# Altium schematic sheet PCI Express_16765X6890_36PIN_Half length.schdoc
size A4
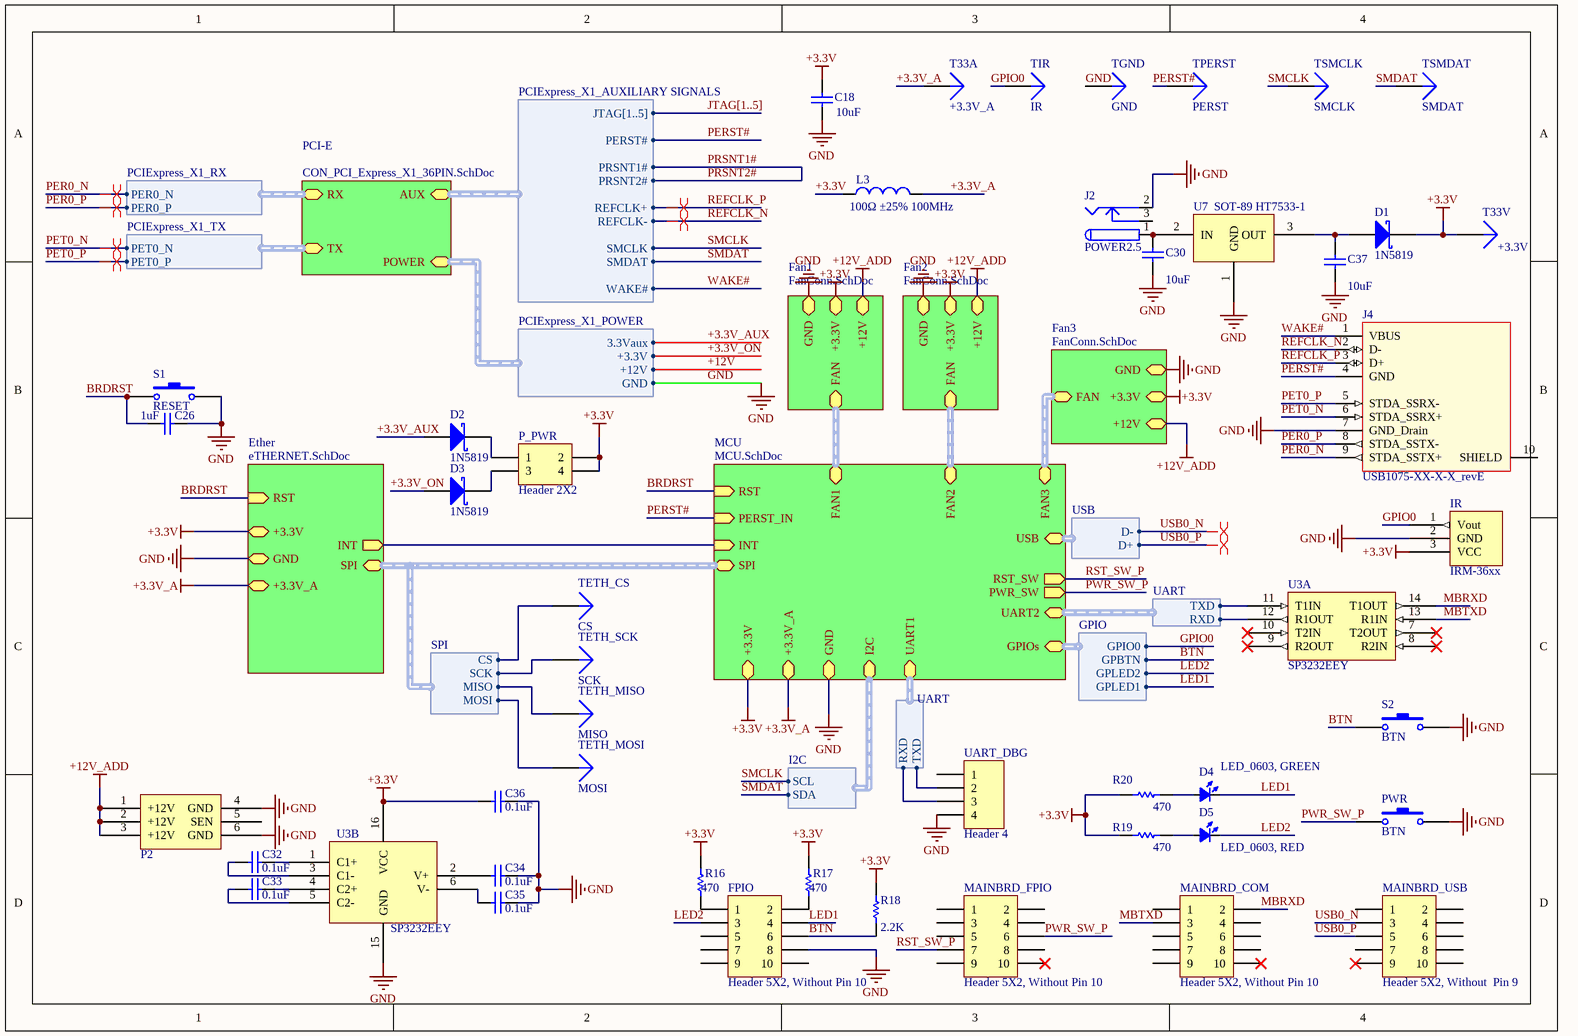
[diagram p0: PCI Express_16765X6890_36PIN_Half length.schdoc]

## Parts
C18  value 10uF  [C-1608[0603]]
C26  value 1uF  [C-1608[0603]]  (hidden comment: Cap Semi)
C30  value 10uF  [C-1608[0603]]
C32  value 0.1uF  [C-1608[0603]]
C33  value 0.1uF  [C-1608[0603]]
C34  value 0.1uF  [C-1608[0603]]
C35  value 0.1uF  [C-1608[0603]]
C36  value 0.1uF  [C-1608[0603]]
C37  value 10uF  [C-1608[0603]]
D1  1N5819  [SOD123]
D2  1N5819  [SOD123]
D3  1N5819  [SOD123]
D4  LED_0603, GREEN  [LED_0603_GREEN]
D5  LED_0603, RED  [LED_0603_RED]
FPIO  Header 5X2, Without Pin 10  [HDR2X5-10]
IR  IRM-36xx  [IRM-36xx]
J2  POWER2.5  [DC_POWER]
J4  USB1075-XX-X-X_revE  [USB1075-XX-X-X_revE]
L3  value 100Ω ±25% 100MHz  [L-1608[0603]]
MAINBRD_COM  Header 5X2, Without Pin 10  [HDR2X5-10]
MAINBRD_FPIO  Header 5X2, Without Pin 10  [HDR2X5-10]
MAINBRD_USB  Header 5X2, Without  Pin 9  [HDR2X5-9]
P2  PCI-E Aux Power Connector 6Pin  [PCIE_AUX_PWR_CONN_6P]  (value not drawn)
P_PWR  Header 2X2  [HDR2X2]
PWR  BTN  [SW-SIDE]
R16  value 470  [R-1608[0603]]
R17  value 470  [R-1608[0603]]
R18  value 2.2K  [R-1608[0603]]
R19  value 470  [R-1608[0603]]
R20  value 470  [R-1608[0603]]
S1  RESET  [SW-2pin-SMD]
S2  BTN  [SW-SIDE]
T33A  +3.3V_A  [TESTPOINT]
T33V  +3.3V  [TESTPOINT]
TETH_CS  CS  [TESTPOINT]
TETH_MISO  MISO  [TESTPOINT]
TETH_MOSI  MOSI  [TESTPOINT]
TETH_SCK  SCK  [TESTPOINT]
TGND  GND  [TESTPOINT]
TIR  IR  [TESTPOINT]
TPERST  PERST  [TESTPOINT]
TSMCLK  SMCLK  [TESTPOINT]
TSMDAT  SMDAT  [TESTPOINT]
U3  SP3232EEY  [LC-TSSOP-16]  (parts A,B of 2)
U7  SOT-89 HT7533-1  [SOT89]
UART_DBG  Header 4  [HDR1X4]

## Sub-sheets
Ether = eTHERNET.SchDoc: +3.3V, GND, +3.3V_A, RST (in), INT (out), SPI (harness SPI)
Fan1 = FanConn.SchDoc: GND, +3.3V, FAN (harness FAN), +12V
Fan2 = FanConn.SchDoc: GND, +3.3V, FAN (harness FAN), +12V
Fan3 = FanConn.SchDoc: GND, +3.3V, FAN (harness FAN), +12V
MCU = MCU.SchDoc: RST (in), +3.3V, GND, SPI (harness SPI), UART1 (harness UART), INT (in), UART2 (harness UART), +3.3V_A, FAN2 (harness FAN), FAN1 (harness FAN), FAN3 (harness FAN), USB (harness USB), I2C (harness I2C), PERST_IN (in), PWR_SW (out), RST_SW (out), GPIOs (harness GPIO)
PCI-E = CON_PCI_Express_X1_36PIN.SchDoc: TX (harness PCIExpress_X1_TX), AUX (harness PCIExpress_X1_AUXILIARY SIGNALS), POWER (harness PCIExpress_X1_POWER), RX (harness PCIExpress_X1_RX)

## Harnesses
PCIExpress_X1_RX: PER0_N, PER0_P
PCIExpress_X1_TX: PET0_N, PET0_P
PCIExpress_X1_POWER: +3.3V, +12V, GND, 3.3Vaux
PCIExpress_X1_AUXILIARY SIGNALS: JTAG[1..5], PERST#, PRSNT1#, PRSNT2#, REFCLK+, REFCLK-, SMCLK, SMDAT, WAKE#
I2C: SCL, SDA
GPIO: GPLED1, GPLED2, GPBTN, GPIO0
USB: D+, D-
UART: TXD, RXD
SPI: MOSI, MISO, SCK, CS

## Nets
+3.3V: C18.2 C36.2 D1.2(K) IR.3(VCC) L3.1 P_PWR.2 P_PWR.4 R16.2 R17.2 R18.2 R19.2 R20.2 T33V.1 U3.16(VCC) ; sheet Ether/+3.3V, sheet MCU/+3.3V, sheet Fan1/+3.3V, sheet Fan2/+3.3V, sheet Fan3/+3.3V
+3.3V_A: L3.2 T33A.1 ; sheet Ether/+3.3V_A, sheet MCU/+3.3V_A
+12V_ADD: P2.1(+12V) P2.2(+12V) P2.3(+12V) ; sheet Fan1/+12V, sheet Fan2/+12V, sheet Fan3/+12V
GND: C18.1 C26.2 C30.1 C34.1 C35.1 C36.1 C37.1 FPIO.8 IR.2(GND) J2.2 J4.7(GND_Drain) P2.4(GND) P2.6(GND) PWR.2 S1.2 S2.2 TGND.1 U3.15(GND) U7.1(GND) UART_DBG.4 ; sheet Ether/GND, sheet MCU/GND, sheet Fan1/GND, sheet Fan2/GND, sheet Fan3/GND, sheet PCI-E/POWER.GND
+3.3V_AUX: D2.1(A) ; sheet PCI-E/POWER.3.3Vaux
+3.3V_ON: D3.1(A) ; sheet PCI-E/POWER.+3.3V
+12V: sheet PCI-E/POWER.+12V
BRDRST: C26.1 S1.1 ; sheet Ether/RST, sheet MCU/RST
BTN: FPIO.6 R18.1 S2.1 ; sheet MCU/GPIOs.GPBTN
GPIO0: IR.1(Vout) TIR.1 ; sheet MCU/GPIOs.GPIO0
LED1: D4.2(K) FPIO.4 ; sheet MCU/GPIOs.GPLED1
LED2: D5.2(K) FPIO.3 ; sheet MCU/GPIOs.GPLED2
MBRXD: MAINBRD_COM.2 U3.14(T1OUT)
MBTXD: MAINBRD_COM.3 U3.13(R1IN)
PER0_N: J4.9(STDA_SSTX+) ; sheet PCI-E/RX.PER0_N
PER0_P: J4.8(STDA_SSTX-) ; sheet PCI-E/RX.PER0_P
PERST#: J4.4(GND) TPERST.1 ; sheet MCU/PERST_IN, sheet PCI-E/AUX.PERST#
PET0_N: J4.6(STDA_SSRX+) ; sheet PCI-E/TX.PET0_N
PET0_P: J4.5(STDA_SSRX-) ; sheet PCI-E/TX.PET0_P
PRSNT1#: sheet PCI-E/AUX.PRSNT1#, sheet PCI-E/AUX.PRSNT2#  [also labelled PRSNT2#]
PWR_SW_P: MAINBRD_FPIO.6 PWR.1 ; sheet MCU/PWR_SW
REFCLK_N: J4.2(D-) ; sheet PCI-E/AUX.REFCLK-
REFCLK_P: J4.3(D+) ; sheet PCI-E/AUX.REFCLK+
RST_SW_P: MAINBRD_FPIO.7 ; sheet MCU/RST_SW
SMCLK: TSMCLK.1 ; sheet PCI-E/AUX.SMCLK, sheet MCU/I2C.SCL
SMDAT: TSMDAT.1 ; sheet PCI-E/AUX.SMDAT, sheet MCU/I2C.SDA
USB0_N: MAINBRD_USB.3 ; sheet MCU/USB.D-
USB0_P: MAINBRD_USB.5 ; sheet MCU/USB.D+
WAKE#: J4.1(VBUS) ; sheet PCI-E/AUX.WAKE#
NetC30_2: C30.2 J2.1 U7.2(IN)
NetC32_1: C32.1 U3.1(C1+)
NetC32_2: C32.2 U3.3(C1-)
NetC33_1: C33.1 U3.4(C2+)
NetC33_2: C33.2 U3.5(C2-)
NetC34_2: C34.2 U3.2(V+)
NetC35_2: C35.2 U3.6(V-)
NetC37_2: C37.2 D1.1(A) U7.3(OUT)
NetD2_2: D2.2(K) P_PWR.1
NetD3_2: D3.2(K) P_PWR.3
NetD4_1: D4.1(A) R20.1
NetD5_1: D5.1(A) R19.1
NetFPIO_1: FPIO.1 R16.1
NetFPIO_2: FPIO.2 R17.1
NetTETH_CS_1: TETH_CS.1 ; sheet Ether/SPI.CS
NetTETH_MISO_1: TETH_MISO.1 ; sheet Ether/SPI.MISO
NetTETH_MOSI_1: TETH_MOSI.1 ; sheet Ether/SPI.MOSI
NetTETH_SCK_1: TETH_SCK.1 ; sheet Ether/SPI.SCK
NetU3_11: U3.11(T1IN) ; sheet MCU/UART2.TXD
NetU3_12: U3.12(R1OUT) ; sheet MCU/UART2.RXD
NetUART_DBG_2: UART_DBG.2 ; sheet MCU/UART1.TXD
NetUART_DBG_3: UART_DBG.3 ; sheet MCU/UART1.RXD
(unnamed): sheet Ether/INT, sheet MCU/INT

Not connected (* = marked no-connect by the designer): FPIO 5 7 9 10; J2 3; J4 10(SHIELD); MAINBRD_COM 1 4 5 6 7 8 9 10*; MAINBRD_FPIO 1 2 3 4 5 8 9 10*; MAINBRD_USB 1 2 4 6 7 8 9* 10; P2 5(SEN); U3 7(T2OUT)* 8(R2IN)* 9(R2OUT)* 10(T2IN)*; UART_DBG 1

## Buses and harness runs
bus JTAG[1..5]
harness sheet Ether/SPI = sheet MCU/SPI
harness sheet Fan1/FAN = sheet MCU/FAN1
harness sheet Fan2/FAN = sheet MCU/FAN2
harness sheet Fan3/FAN = sheet MCU/FAN3

## Layout directives
differential pair: PER0_N, PER0_P, PET0_N, PET0_P, REFCLK_N, REFCLK_P, USB0_N, USB0_P

## Notes on the sheet
- Title
- Size:
- Date:
- A4
- Number:
- Time:
- Revision:
- Sheet
- of
- File:

## Library data of the parts
C18 C26 C30 C32-C37 = Cap Semi: Capacitor (Semiconductor SIM Model); Published: 8-Jun-2000; LatestRevisionDate: 29-May-2009; LatestRevisionNote: IPC-7351 Footprint Added.; PackageReference: C1206; Publisher: Altium Limited; PackageDescription: Chip Capacitor
D1-D3 = D Schottky: Schottky Diode; Published: 8-Jun-2000; LatestRevisionDate: 17-Jul-2002; LatestRevisionNote: Re-released for DXP Platform.; PackageReference: SMB; Publisher: Altium Limited; PackageDescription: DO-214-AA/SMB; 2 C-Bend Leads; Body 5.3 x 3.6 mm, inc. leads (LxW); Code_JEDEC: DO-214-AA
D4 D5 = LED_0603: LED
FPIO MAINBRD_COM MAINBRD_FPIO MAINBRD_USB = Header 5X2: Header, 5-Pin, Dual row; LatestRevisionDate: 17-Jul-2002; LatestRevisionNote: Re-released for DXP Platform.; Publisher: Altium Limited
J4 = USB1075-XX-X-X_revE: USB 3.0 Receptecal, Type A, 9 Pin, Through Hole, Horizontal, Top Mount, with Kinked Shell Stakes
L3 = Inductor: Code_IEC: 1005; Published: 8-Jun-2000; LatestRevisionDate: 29-May-2009; LatestRevisionNote: IPC-7351 Footprint Added.; PackageReference: 0402-A; Publisher: Altium Limited; PackageDescription: Chip Inductor; Code_JEITA: 0402
P_PWR = Header 2X2: Header, 2-Pin, Dual row; LatestRevisionDate: 17-Jul-2002; LatestRevisionNote: Re-released for DXP Platform.; Publisher: Altium Limited
PWR S1 S2 = SW-PB: Switch; Published: 24-Mar-1999; LatestRevisionDate: 17-Jul-2002; LatestRevisionNote: Re-released for DXP Platform.; PackageReference: SPST-2; Publisher: Altium Limited
R16-R20 = Res Semi: Semiconductor Resistor; Published: 8-Jun-2000; LatestRevisionDate: 17-Jul-2002; LatestRevisionNote: Re-released for DXP Platform.; PackageReference: AXIAL-0.5; Publisher: Altium Limited; PackageDescription: Axial Device, Thru-Hole; 2 Leads; 0.5 in Pin Spacing
T33A T33V TETH_CS TETH_MISO TETH_MOSI TETH_SCK TGND TIR TPERST TSMCLK TSMDAT = Plug: LatestRevisionDate: 17-Jul-2002; LatestRevisionNote: Re-released for DXP Platform.; Publisher: Altium Limited
U7 = HT73XX: Low Power Consumption LDO
UART_DBG = Header 4: Header, 4-Pin; LatestRevisionDate: 17-Jul-2002; LatestRevisionNote: Re-released for DXP Platform.; Publisher: Altium Limited